# Altium schematic sheet Current_DAC.SchDoc: Current DAC
size 381 x 330 mm; DrawnBy: Braulio Cancino Vera
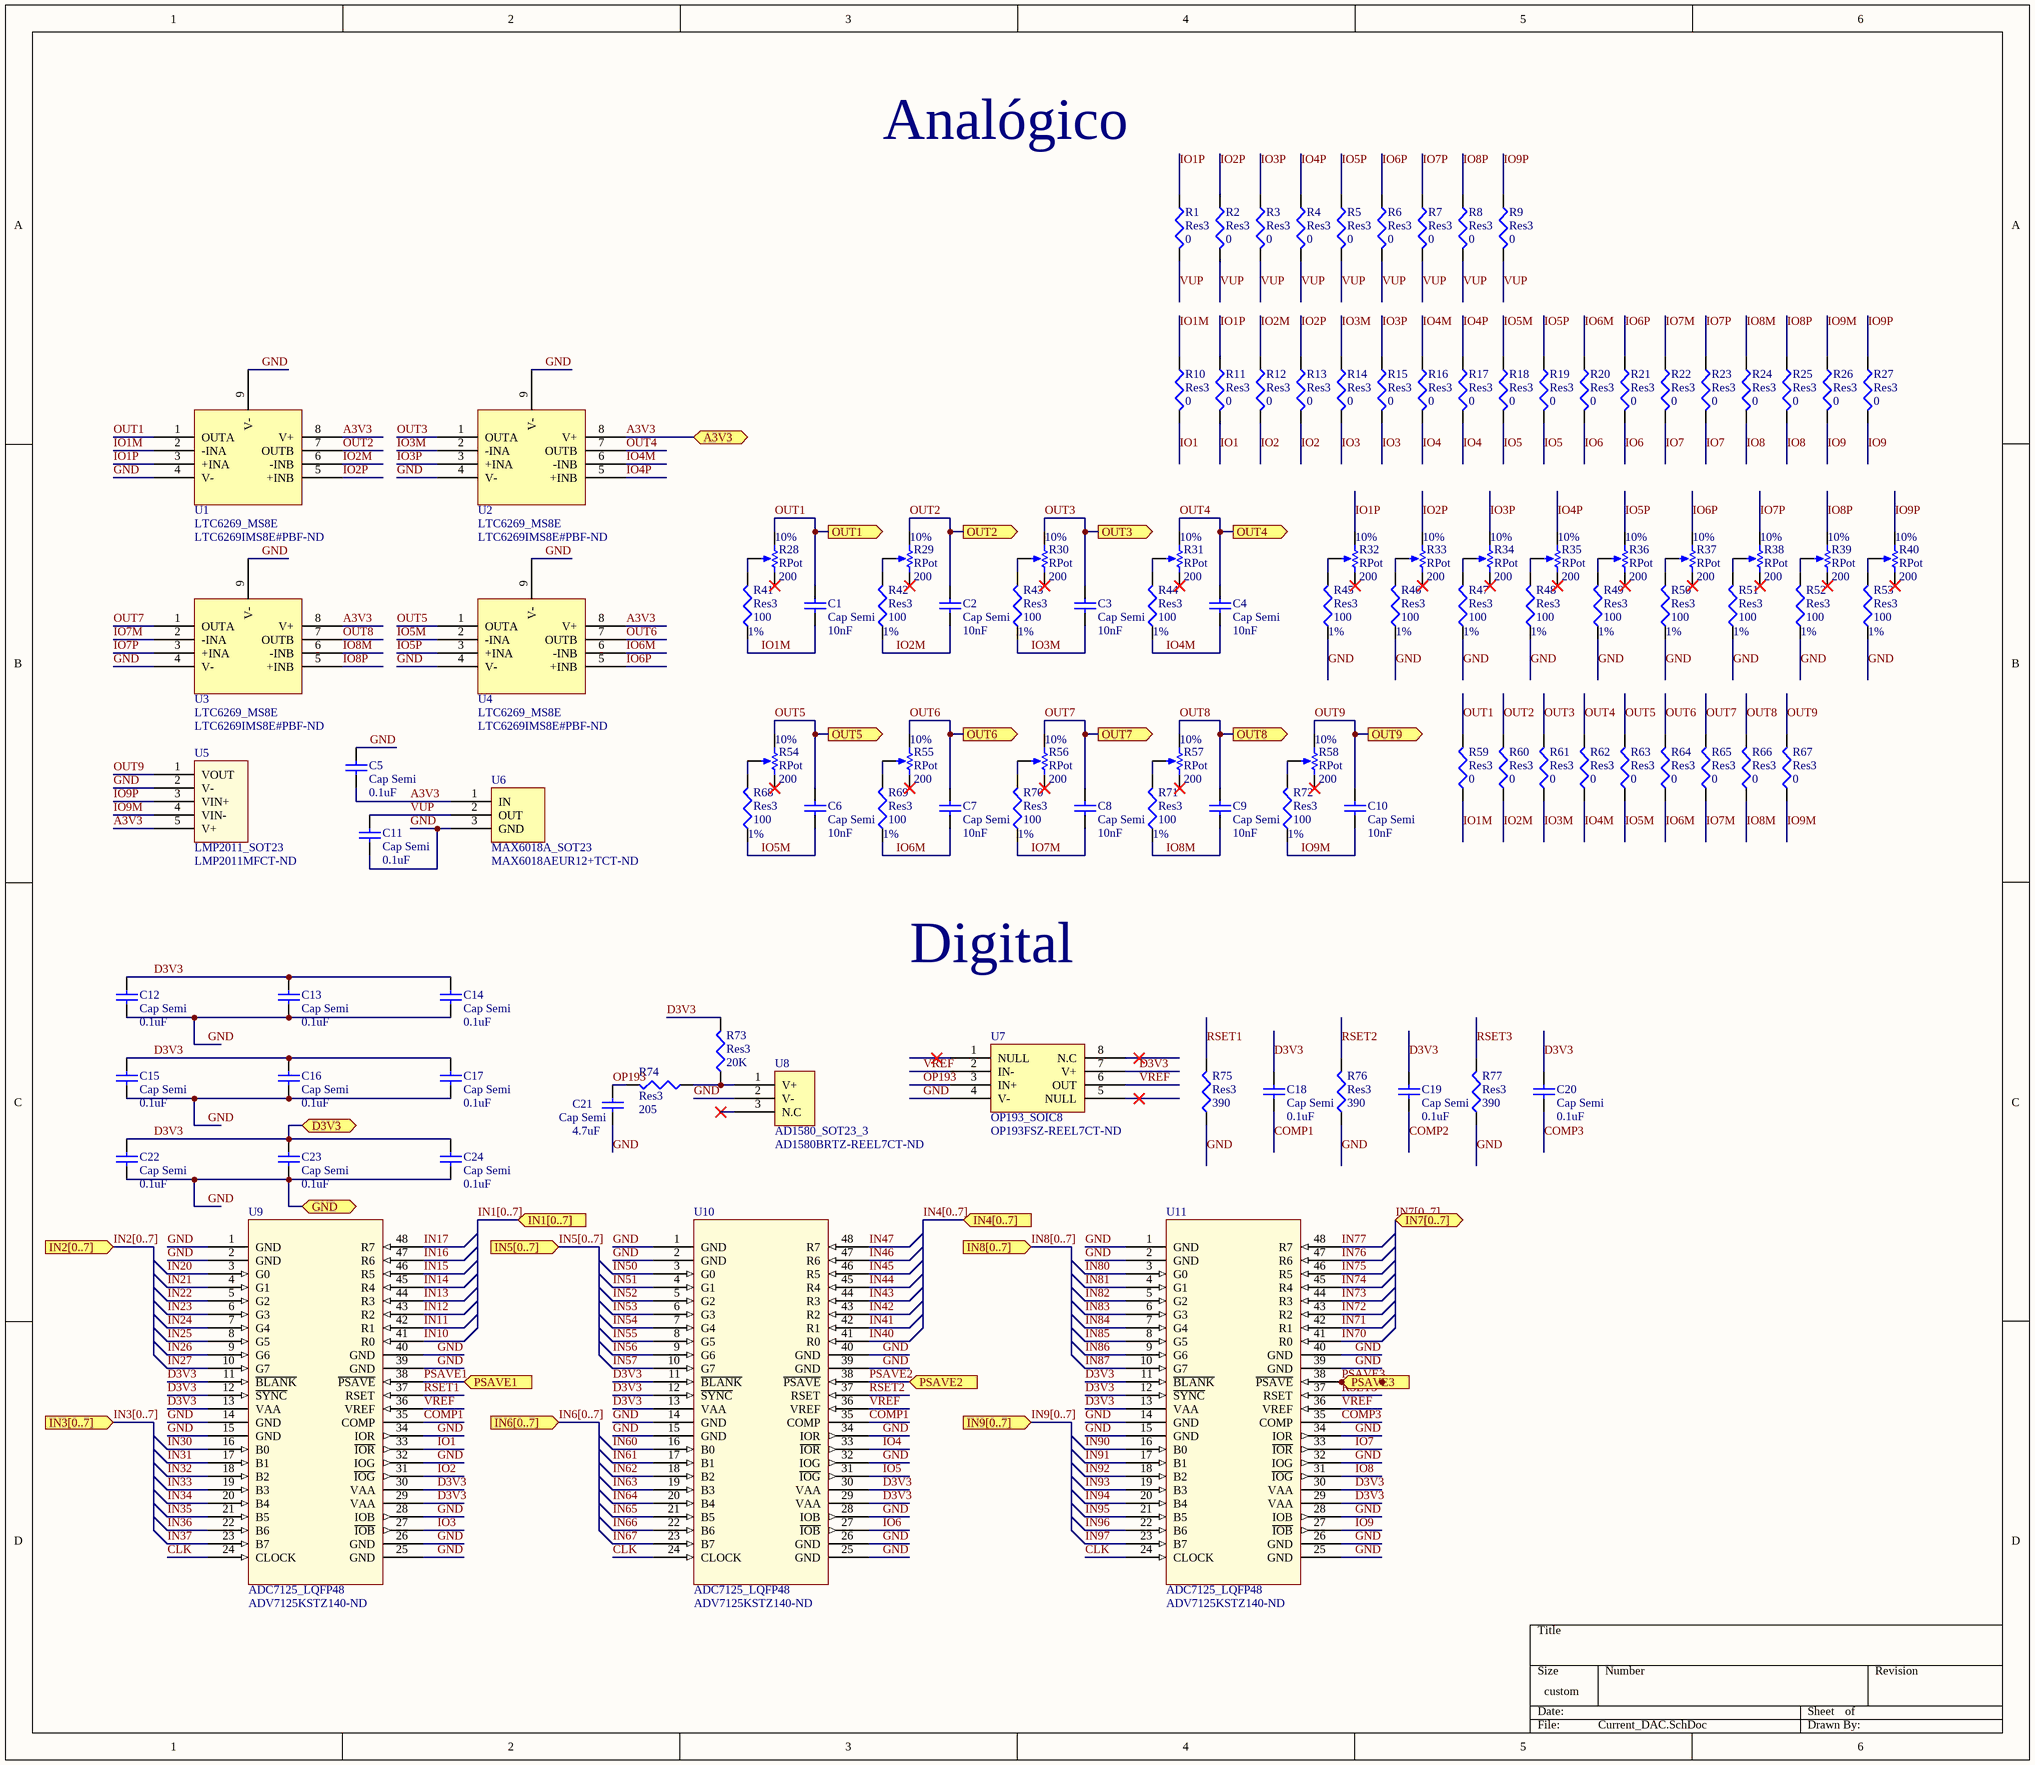
[diagram p0: Current_DAC.SchDoc]

## Parts
C1  Cap Semi  value 10nF  [J1-0603]
C2  Cap Semi  value 10nF  [J1-0603]
C3  Cap Semi  value 10nF  [J1-0603]
C4  Cap Semi  value 10nF  [J1-0603]
C5  Cap Semi  value 0.1uF  [J1-0603]
C6  Cap Semi  value 10nF  [J1-0603]
C7  Cap Semi  value 10nF  [J1-0603]
C8  Cap Semi  value 10nF  [J1-0603]
C9  Cap Semi  value 10nF  [J1-0603]
C10  Cap Semi  value 10nF  [J1-0603]
C11  Cap Semi  value 0.1uF  [J1-0603]
C12  Cap Semi  value 0.1uF  [J1-0603]
C13  Cap Semi  value 0.1uF  [J1-0603]
C14  Cap Semi  value 0.1uF  [J1-0603]
C15  Cap Semi  value 0.1uF  [J1-0603]
C16  Cap Semi  value 0.1uF  [J1-0603]
C17  Cap Semi  value 0.1uF  [J1-0603]
C18  Cap Semi  value 0.1uF  [J1-0603]
C19  Cap Semi  value 0.1uF  [J1-0603]
C20  Cap Semi  value 0.1uF  [J1-0603]
C21  Cap Semi  value 4.7uF  [J1-0603]
C22  Cap Semi  value 0.1uF  [J1-0603]
C23  Cap Semi  value 0.1uF  [J1-0603]
C24  Cap Semi  value 0.1uF  [J1-0603]
R1  Res3  value 0  [J1-0603]
R2  Res3  value 0  [J1-0603]
R3  Res3  value 0  [J1-0603]
R4  Res3  value 0  [J1-0603]
R5  Res3  value 0  [J1-0603]
R6  Res3  value 0  [J1-0603]
R7  Res3  value 0  [J1-0603]
R8  Res3  value 0  [J1-0603]
R9  Res3  value 0  [J1-0603]
R10  Res3  value 0  [J1-0603]
R11  Res3  value 0  [J1-0603]
R12  Res3  value 0  [J1-0603]
R13  Res3  value 0  [J1-0603]
R14  Res3  value 0  [J1-0603]
R15  Res3  value 0  [J1-0603]
R16  Res3  value 0  [J1-0603]
R17  Res3  value 0  [J1-0603]
R18  Res3  value 0  [J1-0603]
R19  Res3  value 0  [J1-0603]
R20  Res3  value 0  [J1-0603]
R21  Res3  value 0  [J1-0603]
R22  Res3  value 0  [J1-0603]
R23  Res3  value 0  [J1-0603]
R24  Res3  value 0  [J1-0603]
R25  Res3  value 0  [J1-0603]
R26  Res3  value 0  [J1-0603]
R27  Res3  value 0  [J1-0603]
R28  RPot  value 200  Tol: 10%  [TS63Y_POT]
R29  RPot  value 200  Tol: 10%  [TS63Y_POT]
R30  RPot  value 200  Tol: 10%  [TS63Y_POT]
R31  RPot  value 200  Tol: 10%  [TS63Y_POT]
R32  RPot  value 200  Tol: 10%  [TS63Y_POT]
R33  RPot  value 200  Tol: 10%  [TS63Y_POT]
R34  RPot  value 200  Tol: 10%  [TS63Y_POT]
R35  RPot  value 200  Tol: 10%  [TS63Y_POT]
R36  RPot  value 200  Tol: 10%  [TS63Y_POT]
R37  RPot  value 200  Tol: 10%  [TS63Y_POT]
R38  RPot  value 200  Tol: 10%  [TS63Y_POT]
R39  RPot  value 200  Tol: 10%  [TS63Y_POT]
R40  RPot  value 200  Tol: 10%  [TS63Y_POT]
R41  Res3  value 100  Tol: 1%  [J1-0603]
R42  Res3  value 100  Tol: 1%  [J1-0603]
R43  Res3  value 100  Tol: 1%  [J1-0603]
R44  Res3  value 100  Tol: 1%  [J1-0603]
R45  Res3  value 100  Tol: 1%  [J1-0603]
R46  Res3  value 100  Tol: 1%  [J1-0603]
R47  Res3  value 100  Tol: 1%  [J1-0603]
R48  Res3  value 100  Tol: 1%  [J1-0603]
R49  Res3  value 100  Tol: 1%  [J1-0603]
R50  Res3  value 100  Tol: 1%  [J1-0603]
R51  Res3  value 100  Tol: 1%  [J1-0603]
R52  Res3  value 100  Tol: 1%  [J1-0603]
R53  Res3  value 100  Tol: 1%  [J1-0603]
R54  RPot  value 200  Tol: 10%  [TS63Y_POT]
R55  RPot  value 200  Tol: 10%  [TS63Y_POT]
R56  RPot  value 200  Tol: 10%  [TS63Y_POT]
R57  RPot  value 200  Tol: 10%  [TS63Y_POT]
R58  RPot  value 200  Tol: 10%  [TS63Y_POT]
R59  Res3  value 0  [J1-0603]
R60  Res3  value 0  [J1-0603]
R61  Res3  value 0  [J1-0603]
R62  Res3  value 0  [J1-0603]
R63  Res3  value 0  [J1-0603]
R64  Res3  value 0  [J1-0603]
R65  Res3  value 0  [J1-0603]
R66  Res3  value 0  [J1-0603]
R67  Res3  value 0  [J1-0603]
R68  Res3  value 100  Tol: 1%  [J1-0603]
R69  Res3  value 100  Tol: 1%  [J1-0603]
R70  Res3  value 100  Tol: 1%  [J1-0603]
R71  Res3  value 100  Tol: 1%  [J1-0603]
R72  Res3  value 100  Tol: 1%  [J1-0603]
R73  Res3  value 20K  [J1-0603]
R74  Res3  value 205  [J1-0603]
R75  Res3  value 390  [J1-0603]
R76  Res3  value 390  [J1-0603]
R77  Res3  value 390  [J1-0603]
U1  LTC6269_MS8E  Supplier Part Number 1: LTC6269IMS8E#PBF-ND  [LTC6269_MSOP8]
U2  LTC6269_MS8E  Supplier Part Number 1: LTC6269IMS8E#PBF-ND  [LTC6269_MSOP8]
U3  LTC6269_MS8E  Supplier Part Number 1: LTC6269IMS8E#PBF-ND  [LTC6269_MSOP8]
U4  LTC6269_MS8E  Supplier Part Number 1: LTC6269IMS8E#PBF-ND  [LTC6269_MSOP8]
U5  LMP2011_SOT23  Supplier Part Number 1: LMP2011MFCT-ND  [LMP2011_SOT23]
U6  MAX6018A_SOT23  Supplier Part Number 1: MAX6018AEUR12+TCT-ND  [MAX6018A_SOT23]
U7  OP193_SOIC8  Supplier Part Number 1: OP193FSZ-REEL7CT-ND  [OP193_SOIC8]
U8  AD1580_SOT23_3  Supplier Part Number 1: AD1580BRTZ-REEL7CT-ND  [AD1580_SOT23_3]
U9  ADC7125_LQFP48  Supplier Part Number 1: ADV7125KSTZ140-ND  [ADV7125_LQFP48]
U10  ADC7125_LQFP48  Supplier Part Number 1: ADV7125KSTZ140-ND  [ADV7125_LQFP48]
U11  ADC7125_LQFP48  Supplier Part Number 1: ADV7125KSTZ140-ND  [ADV7125_LQFP48]

## Ports
A3V3 (bidir), D3V3 (bidir), GND (bidir), IN1[0..7] (in), IN2[0..7] (in), IN3[0..7] (in), IN4[0..7] (in), IN5[0..7] (in), IN6[0..7] (in), IN7[0..7] (in), IN8[0..7] (in), IN9[0..7] (in), OUT1 (out), OUT2 (out), OUT3 (out), OUT4 (out), OUT5 (out), OUT6 (out), OUT7 (out), OUT8 (out), OUT9 (out), PSAVE1 (in), PSAVE2 (in), PSAVE3 (in)

## Nets
A3V3: C5.1 U1.8(V+) U2.8(V+) U3.8(V+) U4.8(V+) U5.5(V+) U6.1(IN) ; port A3V3
CLK: U9.24(CLOCK) U10.24(CLOCK) U11.24(CLOCK)
COMP1: C18.1 U9.35(COMP) U10.35(COMP)
COMP2: C19.1
COMP3: C20.1 U11.35(COMP)
D3V3: C12.1 C13.1 C14.1 C15.1 C16.1 C17.1 C18.2 C19.2 C20.2 C22.1 C23.1 C24.1 R73.2 U7.7(V+) U9.11(~{BLANK}) U9.12(~{SYNC}) U9.13(VAA) U9.29(VAA) U9.30(VAA) U10.11(~{BLANK}) U10.12(~{SYNC}) U10.13(VAA) U10.29(VAA) U10.30(VAA) U11.11(~{BLANK}) U11.12(~{SYNC}) U11.13(VAA) U11.29(VAA) U11.30(VAA) ; port D3V3
GND: C5.2 C11.1 C12.2 C13.2 C14.2 C15.2 C16.2 C17.2 C21.1 C22.2 C23.2 C24.2 R45.1 R46.1 R47.1 R48.1 R49.1 R50.1 R51.1 R52.1 R53.1 R75.1 R76.1 R77.1 U1.4(V-) U1.9(V-) U2.4(V-) U2.9(V-) U3.4(V-) U3.9(V-) U4.4(V-) U4.9(V-) U5.2(V-) U6.3(GND) U7.4(V-) U8.2(V-) U9.1(GND) U9.2(GND) U9.14(GND) U9.15(GND) U9.25(GND) U9.26(GND) U9.28(IOB) U9.32(IOG) U9.34(IOR) U9.39(GND) U9.40(GND) U10.1(GND) U10.2(GND) U10.14(GND) U10.15(GND) U10.25(GND) U10.26(GND) U10.28(IOB) U10.32(IOG) U10.34(IOR) U10.39(GND) U10.40(GND) U11.1(GND) U11.2(GND) U11.14(GND) U11.15(GND) U11.25(GND) U11.26(GND) U11.28(IOB) U11.32(IOG) U11.34(IOR) U11.39(GND) U11.40(GND) ; port GND
IN10: U9.41(R0)
IN11: U9.42(R1)
IN12: U9.43(R2)
IN13: U9.44(R3)
IN14: U9.45(R4)
IN15: U9.46(R5)
IN16: U9.47(R6)
IN17: U9.48(R7)
IN20: U9.3(G0)
IN21: U9.4(G1)
IN22: U9.5(G2)
IN23: U9.6(G3)
IN24: U9.7(G4)
IN25: U9.8(G5)
IN26: U9.9(G6)
IN27: U9.10(G7)
IN30: U9.16(B0)
IN31: U9.17(B1)
IN32: U9.18(B2)
IN33: U9.19(B3)
IN34: U9.20(B4)
IN35: U9.21(B5)
IN36: U9.22(B6)
IN37: U9.23(B7)
IN40: U10.41(R0)
IN41: U10.42(R1)
IN42: U10.43(R2)
IN43: U10.44(R3)
IN44: U10.45(R4)
IN45: U10.46(R5)
IN46: U10.47(R6)
IN47: U10.48(R7)
IN50: U10.3(G0)
IN51: U10.4(G1)
IN52: U10.5(G2)
IN53: U10.6(G3)
IN54: U10.7(G4)
IN55: U10.8(G5)
IN56: U10.9(G6)
IN57: U10.10(G7)
IN60: U10.16(B0)
IN61: U10.17(B1)
IN62: U10.18(B2)
IN63: U10.19(B3)
IN64: U10.20(B4)
IN65: U10.21(B5)
IN66: U10.22(B6)
IN67: U10.23(B7)
IN70: U11.41(R0)
IN71: U11.42(R1)
IN72: U11.43(R2)
IN73: U11.44(R3)
IN74: U11.45(R4)
IN75: U11.46(R5)
IN76: U11.47(R6)
IN77: U11.48(R7)
IN80: U11.3(G0)
IN81: U11.4(G1)
IN82: U11.5(G2)
IN83: U11.6(G3)
IN84: U11.7(G4)
IN85: U11.8(G5)
IN86: U11.9(G6)
IN87: U11.10(G7)
IN90: U11.16(B0)
IN91: U11.17(B1)
IN92: U11.18(B2)
IN93: U11.19(B3)
IN94: U11.20(B4)
IN95: U11.21(B5)
IN96: U11.22(B6)
IN97: U11.23(B7)
IO1: R10.2 R11.2 U9.33(~{IOR})
IO1M: C1.1 R10.1 R41.1 R59.1 U1.2(-INA)
IO1P: R1.1 R11.1 R32.1(TOP) U1.3(+INA)
IO2: R12.2 R13.2 U9.31(~{IOG})
IO2M: C2.1 R12.1 R42.1 R60.1 U1.6(-INB)
IO2P: R2.1 R13.1 R33.1(TOP) U1.5(+INB)
IO3: R14.2 R15.2 U9.27(~{IOB})
IO3M: C3.1 R14.1 R43.1 R61.1 U2.2(-INA)
IO3P: R3.1 R15.1 R34.1(TOP) U2.3(+INA)
IO4: R16.2 R17.2 U10.33(~{IOR})
IO4M: C4.1 R16.1 R44.1 R62.1 U2.6(-INB)
IO4P: R4.1 R17.1 R35.1(TOP) U2.5(+INB)
IO5: R18.2 R19.2 U10.31(~{IOG})
IO5M: C6.1 R18.1 R63.1 R68.1 U4.2(-INA)
IO5P: R5.1 R19.1 R36.1(TOP) U4.3(+INA)
IO6: R20.2 R21.2 U10.27(~{IOB})
IO6M: C7.1 R20.1 R64.1 R69.1 U4.6(-INB)
IO6P: R6.1 R21.1 R37.1(TOP) U4.5(+INB)
IO7: R22.2 R23.2 U11.33(~{IOR})
IO7M: C8.1 R22.1 R65.1 R70.1 U3.2(-INA)
IO7P: R7.1 R23.1 R38.1(TOP) U3.3(+INA)
IO8: R24.2 R25.2 U11.31(~{IOG})
IO8M: C9.1 R24.1 R66.1 R71.1 U3.6(-INB)
IO8P: R8.1 R25.1 R39.1(TOP) U3.5(+INB)
IO9: R26.2 R27.2 U11.27(~{IOB})
IO9M: C10.1 R26.1 R67.1 R72.1 U5.4(VIN-)
IO9P: R9.1 R27.1 R40.1(TOP) U5.3(VIN+)
OP193: C21.2 R74.2 U7.3(IN+)
OUT1: C1.2 R28.1(TOP) R59.2 U1.1(OUTA) ; port OUT1
OUT2: C2.2 R29.1(TOP) R60.2 U1.7(OUTB) ; port OUT2
OUT3: C3.2 R30.1(TOP) R61.2 U2.1(OUTA) ; port OUT3
OUT4: C4.2 R31.1(TOP) R62.2 U2.7(OUTB) ; port OUT4
OUT5: C6.2 R54.1(TOP) R63.2 U4.1(OUTA) ; port OUT5
OUT6: C7.2 R55.1(TOP) R64.2 U4.7(OUTB) ; port OUT6
OUT7: C8.2 R56.1(TOP) R65.2 U3.1(OUTA) ; port OUT7
OUT8: C9.2 R57.1(TOP) R66.2 U3.7(OUTB) ; port OUT8
OUT9: C10.2 R58.1(TOP) R67.2 U5.1(VOUT) ; port OUT9
PSAVE1: U9.38(~{PSAVE}) ; port PSAVE1
PSAVE2: U10.38(~{PSAVE}) ; port PSAVE2
PSAVE3: U11.38(~{PSAVE}) ; port PSAVE3
RSET1: R75.2 U9.37(RSET)
RSET2: R76.2 U10.37(RSET)
RSET3: R77.2 U11.37(RSET)
VREF: U7.2(IN-) U7.6(OUT) U9.36(VREF) U10.36(VREF) U11.36(VREF)
VUP: C11.2 R1.2 R2.2 R3.2 R4.2 R5.2 R6.2 R7.2 R8.2 R9.2 U6.2(OUT)
NetR28_3: R28.3(TAP) R41.2
NetR29_3: R29.3(TAP) R42.2
NetR30_3: R30.3(TAP) R43.2
NetR31_3: R31.3(TAP) R44.2
NetR32_3: R32.3(TAP) R45.2
NetR33_3: R33.3(TAP) R46.2
NetR34_3: R34.3(TAP) R47.2
NetR35_3: R35.3(TAP) R48.2
NetR36_3: R36.3(TAP) R49.2
NetR37_3: R37.3(TAP) R50.2
NetR38_3: R38.3(TAP) R51.2
NetR39_3: R39.3(TAP) R52.2
NetR40_3: R40.3(TAP) R53.2
NetR54_3: R54.3(TAP) R68.2
NetR55_3: R55.3(TAP) R69.2
NetR56_3: R56.3(TAP) R70.2
NetR57_3: R57.3(TAP) R71.2
NetR58_3: R58.3(TAP) R72.2
NetR73_1: R73.1 R74.1 U8.1(V+)

Not connected (* = marked no-connect by the designer): R28 2(BOT)*; R29 2(BOT)*; R30 2(BOT)*; R31 2(BOT)*; R32 2(BOT)*; R33 2(BOT)*; R34 2(BOT)*; R35 2(BOT)*; R36 2(BOT)*; R37 2(BOT)*; R38 2(BOT)*; R39 2(BOT)*; R40 2(BOT)*; R54 2(BOT)*; R55 2(BOT)*; R56 2(BOT)*; R57 2(BOT)*; R58 2(BOT)*; U7 1(NULL)* 5(NULL)* 8(N.C)*; U8 3(N.C)*

## Buses and harness runs
bus IN1[0..7] = port IN1[0..7]
bus IN2[0..7] = port IN2[0..7]
bus IN3[0..7] = port IN3[0..7]
bus IN4[0..7] = port IN4[0..7]
bus IN5[0..7] = port IN5[0..7]
bus IN6[0..7] = port IN6[0..7]
bus IN7[0..7] = port IN7[0..7]
bus IN8[0..7] = port IN8[0..7]
bus IN9[0..7] = port IN9[0..7]

## Notes on the sheet
- Analógico
- Digital

## Library data of the parts
C1-C24 = Cap Semi: Capacitor (Semiconductor SIM Model); Published: 8-Jun-2000; LatestRevisionDate: 29-May-2009; LatestRevisionNote: IPC-7351 Footprint Added.; PackageReference: C1206; Publisher: Altium Limited; PackageDescription: Chip Capacitor
R1-R27 R59-R67 = Res3: Resistor; Tol: 1%; Published: 8-Jun-2000; LatestRevisionDate: 29-May-2009; LatestRevisionNote: IPC-7351 Footprint Added.; PackageReference: J1-0603; Publisher: Altium Limited; PackageDescription: Chip Resistor
R28-R40 R54-R58 = RPot: Potentiometer; Sim Note: Enter the Resistance value and the set point into parameter fields.; Set Position: 0.5; Published: 8-Jun-2000; LatestRevisionDate: 17-Jul-2002; LatestRevisionNote: Re-released for DXP Platform.; PackageReference: VR5; Publisher: Altium Limited; PackageDescription: Variable Resistor, Thru-Hole; 3 Leads
R41-R53 R68-R77 = Res3: Resistor; Published: 8-Jun-2000; LatestRevisionDate: 29-May-2009; LatestRevisionNote: IPC-7351 Footprint Added.; PackageReference: J1-0603; Publisher: Altium Limited; PackageDescription: Chip Resistor
U1-U4 = LTC6269_MS8E: Supplier 1: Digi-Key
U5 = LMP2011_SOT23: Supplier 1: Digi-Key
U6 = MAX6018A_SOT23: Supplier 1: Digi-Key
U7 = OP193_SOIC8: Supplier 1: Digi-Key
U8 = AD1580_SOT23_3: Supplier 1: Digi-Key
U9-U11 = ADC7125_LQFP48: Supplier 1: Digi-Key